# EAGLE design hacker (EAGLE 7.1.0)
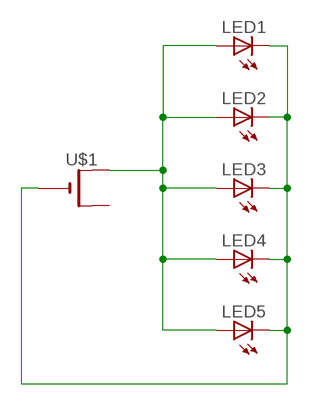
[diagram p0: schematic, sheet 1]

## Parts
LED1  LED5MM  [LED5MM]
LED2  LED5MM  [LED5MM]
LED3  LED5MM  [LED5MM]
LED4  LED5MM  [LED5MM]
LED5  LED5MM  [LED5MM]
U$1  CR1220THM  [CR1220-THM]

## Nets
N$1: LED1.A LED2.A LED3.A LED4.A LED5.A U$1.+1(+)
N$2: LED1.K(C) LED2.K(C) LED3.K(C) LED4.K(C) LED5.K(C) U$1.-
Unconnected: U$1.+2(+1)

## Library data of the parts
LED1-LED5 = adafruit:LED: LED OSRAM: - CHIPLED LG R971, LG N971, LY N971, LG Q971, LY Q971, LO R971, LY R971 LH N974, LH R974 LS Q976, LO Q976, LY Q976 LO Q996 - Hyper CHIPLED LW Q18S LB Q993, LB Q99A, LB R99A - SideLED LS A670, LO A670, LY A670, LG A670, LP A670 LB A673, LV A673, LT A673, LW A673 LH A674 LY A675 LS A676, LA A676, LO A676, LY A676, LW A676 LS A679, LY A679, LG A679 - Hyper Micro SIDELED® LS Y876, LA Y876, LO Y876, LY Y876 LT Y87S - SmartLED LW L88C, LW L88S LB L89C, LB L89S, LG L890 LS L89K, LO L89K, LY L89K LS L896, LA L896, LO L896, LY L896 - TOPLED LS T670, LO T670, LY T670, LG T670, LP T670 LSG T670, LSP T670, LSY T670, LOP T670, LYG T670 LG T671, LOG T671, LSG T671 LB T673, LV T673, LT T673, LW T673 LH T674 LS T676, LA T676, LO T676, LY T676, LB T676, LH T676, LSB T676, LW T676 LB T67C, LV T67C, LT T67C, LS T67K, LO T67K, LY T67K, LW E67C LS E67B, LA E67B, LO E67B, LY E67B, LB E67C, LV E67C, LT E67C LW T67C LS T679, LY T679, LG T679 LS T770, LO T770, LY T770, LG T770, LP T770 LB T773, LV T773, LT T773, LW T773 LH T774 LS E675, LA E675, LY E675, LS T675 LS T776, LA T776, LO T776, LY T776, LB T776 LHGB T686 LT T68C, LB T68C - Hyper Mini TOPLED® LB M676 - Mini TOPLED Santana® LG M470 LS M47K, LO M47K, LY M47K Source: http://www.osram.convergy.de/
U$1 = adafruit:CR1220: CR1216/CR1220/CR1225 12mm 3V lithium coin cell Great for battery packup. Both SMT and THM holders. Note the THM package has the ground pads on both sides of the PCB so that the masks are the same - this reduces the cost

## Board
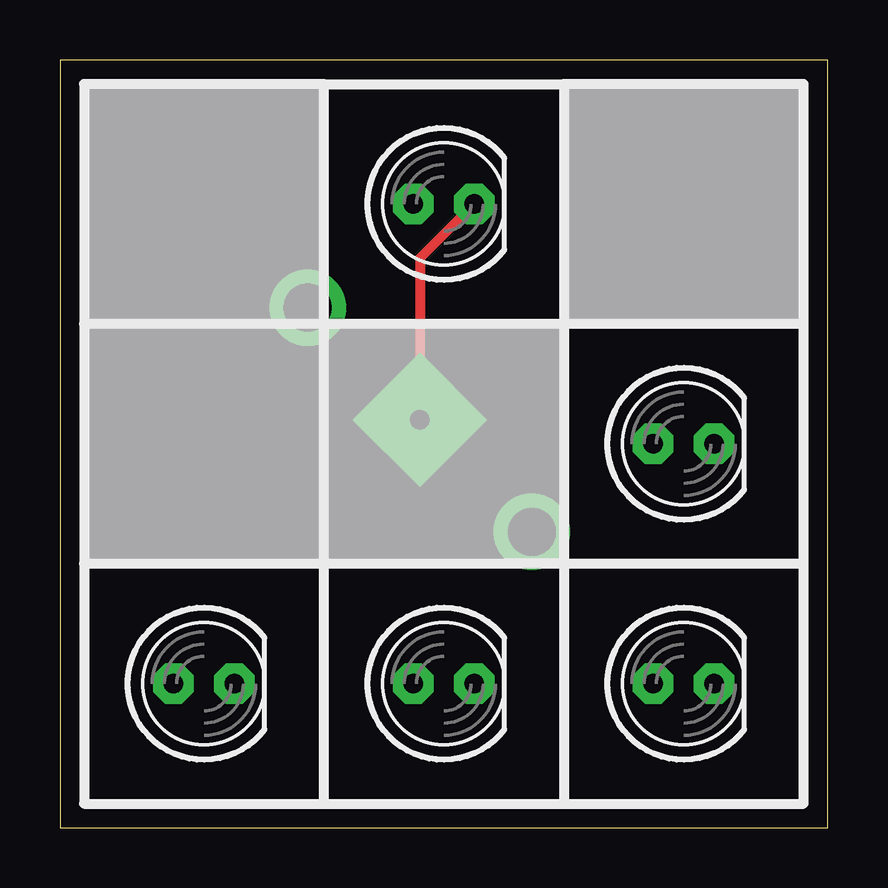
[diagram p1: board, top side]
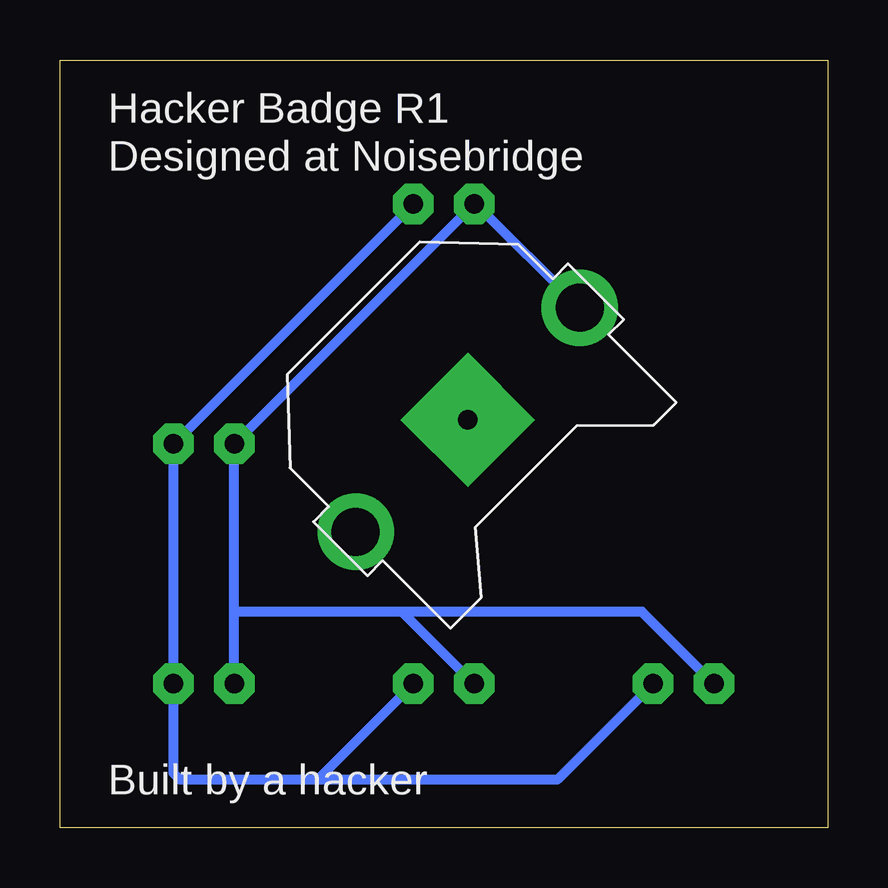
[diagram p2: board, bottom side, seen from below]

Size 32 x 32 mm. Coordinates in mm from the lower left corner, seen from the top.
Outline: 0,0 32,0 32,32 0,32 0,0
Copper layers (1*16): Top 0.035mm / dielectric 1.5mm / Bottom 0.035mm
Design rules "default": minimum track width 10mil, minimum drill 0.6mm, track to track 8mil, track to pad 8mil, pad to pad 8mil, via to via 8mil, smd to smd 8mil, copper to edge 40mil, drill to drill 8mil, minimum pad ring 10mil, minimum via ring 8mil, stop-mask expansion 4mil, vias tented up to drill 0mil, thermal gap 10mil

### Footprints (pad centres in the part's own frame; a part is rotated, then mirrored left to right if it is on the bottom)
LED5MM = drill 0.813 pad 1.676 octagon: A -1.27,0; K 1.27,0
CR1220-THM = drill 2 pad 3.175: +1 -6.604,0; +2 6.604,0 | drill 0.8 pad 3.962 square: - 0,0

### Placement (x,y rotation side)
LED1  26,6 0 top
LED2  6,6 0 top
LED3  16,6 0 top
LED4  16,26 0 top
LED5  26,16 0 top
U$1  15,17 225 bottom

### Tracks (layer width: path | path; a pad name or v marks a point on that pad's centre or on a via)
N$1
  Bottom 0.406: U$1.+1 14.66,26 LED4.A LED5.A 24.73,9 | LED1.A 24.73,9 | LED3.A 17.73,9 | 17.73,9 24.73,9 | LED2.A 7.73,9 17.73,9
N$2
  Top 0.406: LED4.K 15,23.73 U$1.-
  Bottom 0.406: 21.27,2 27,2 27.27,2.27 LED1.K LED5.K LED4.K | 21.27,2 LED3.K | LED2.K 11.27,2 21.27,2

### Text on the board
bPlace: Hacker Badge R1 | Designed at Noisebridge | Built by a hacker